# Altium schematic sheet Ampifiler.SchDoc: Sound Card Amplifiers
size Tabloid; Date: 05/10/2023; Engineer: Terry D. Scchevker; Revision: 1.0; SheetNumber: 2; SheetTotal: 4
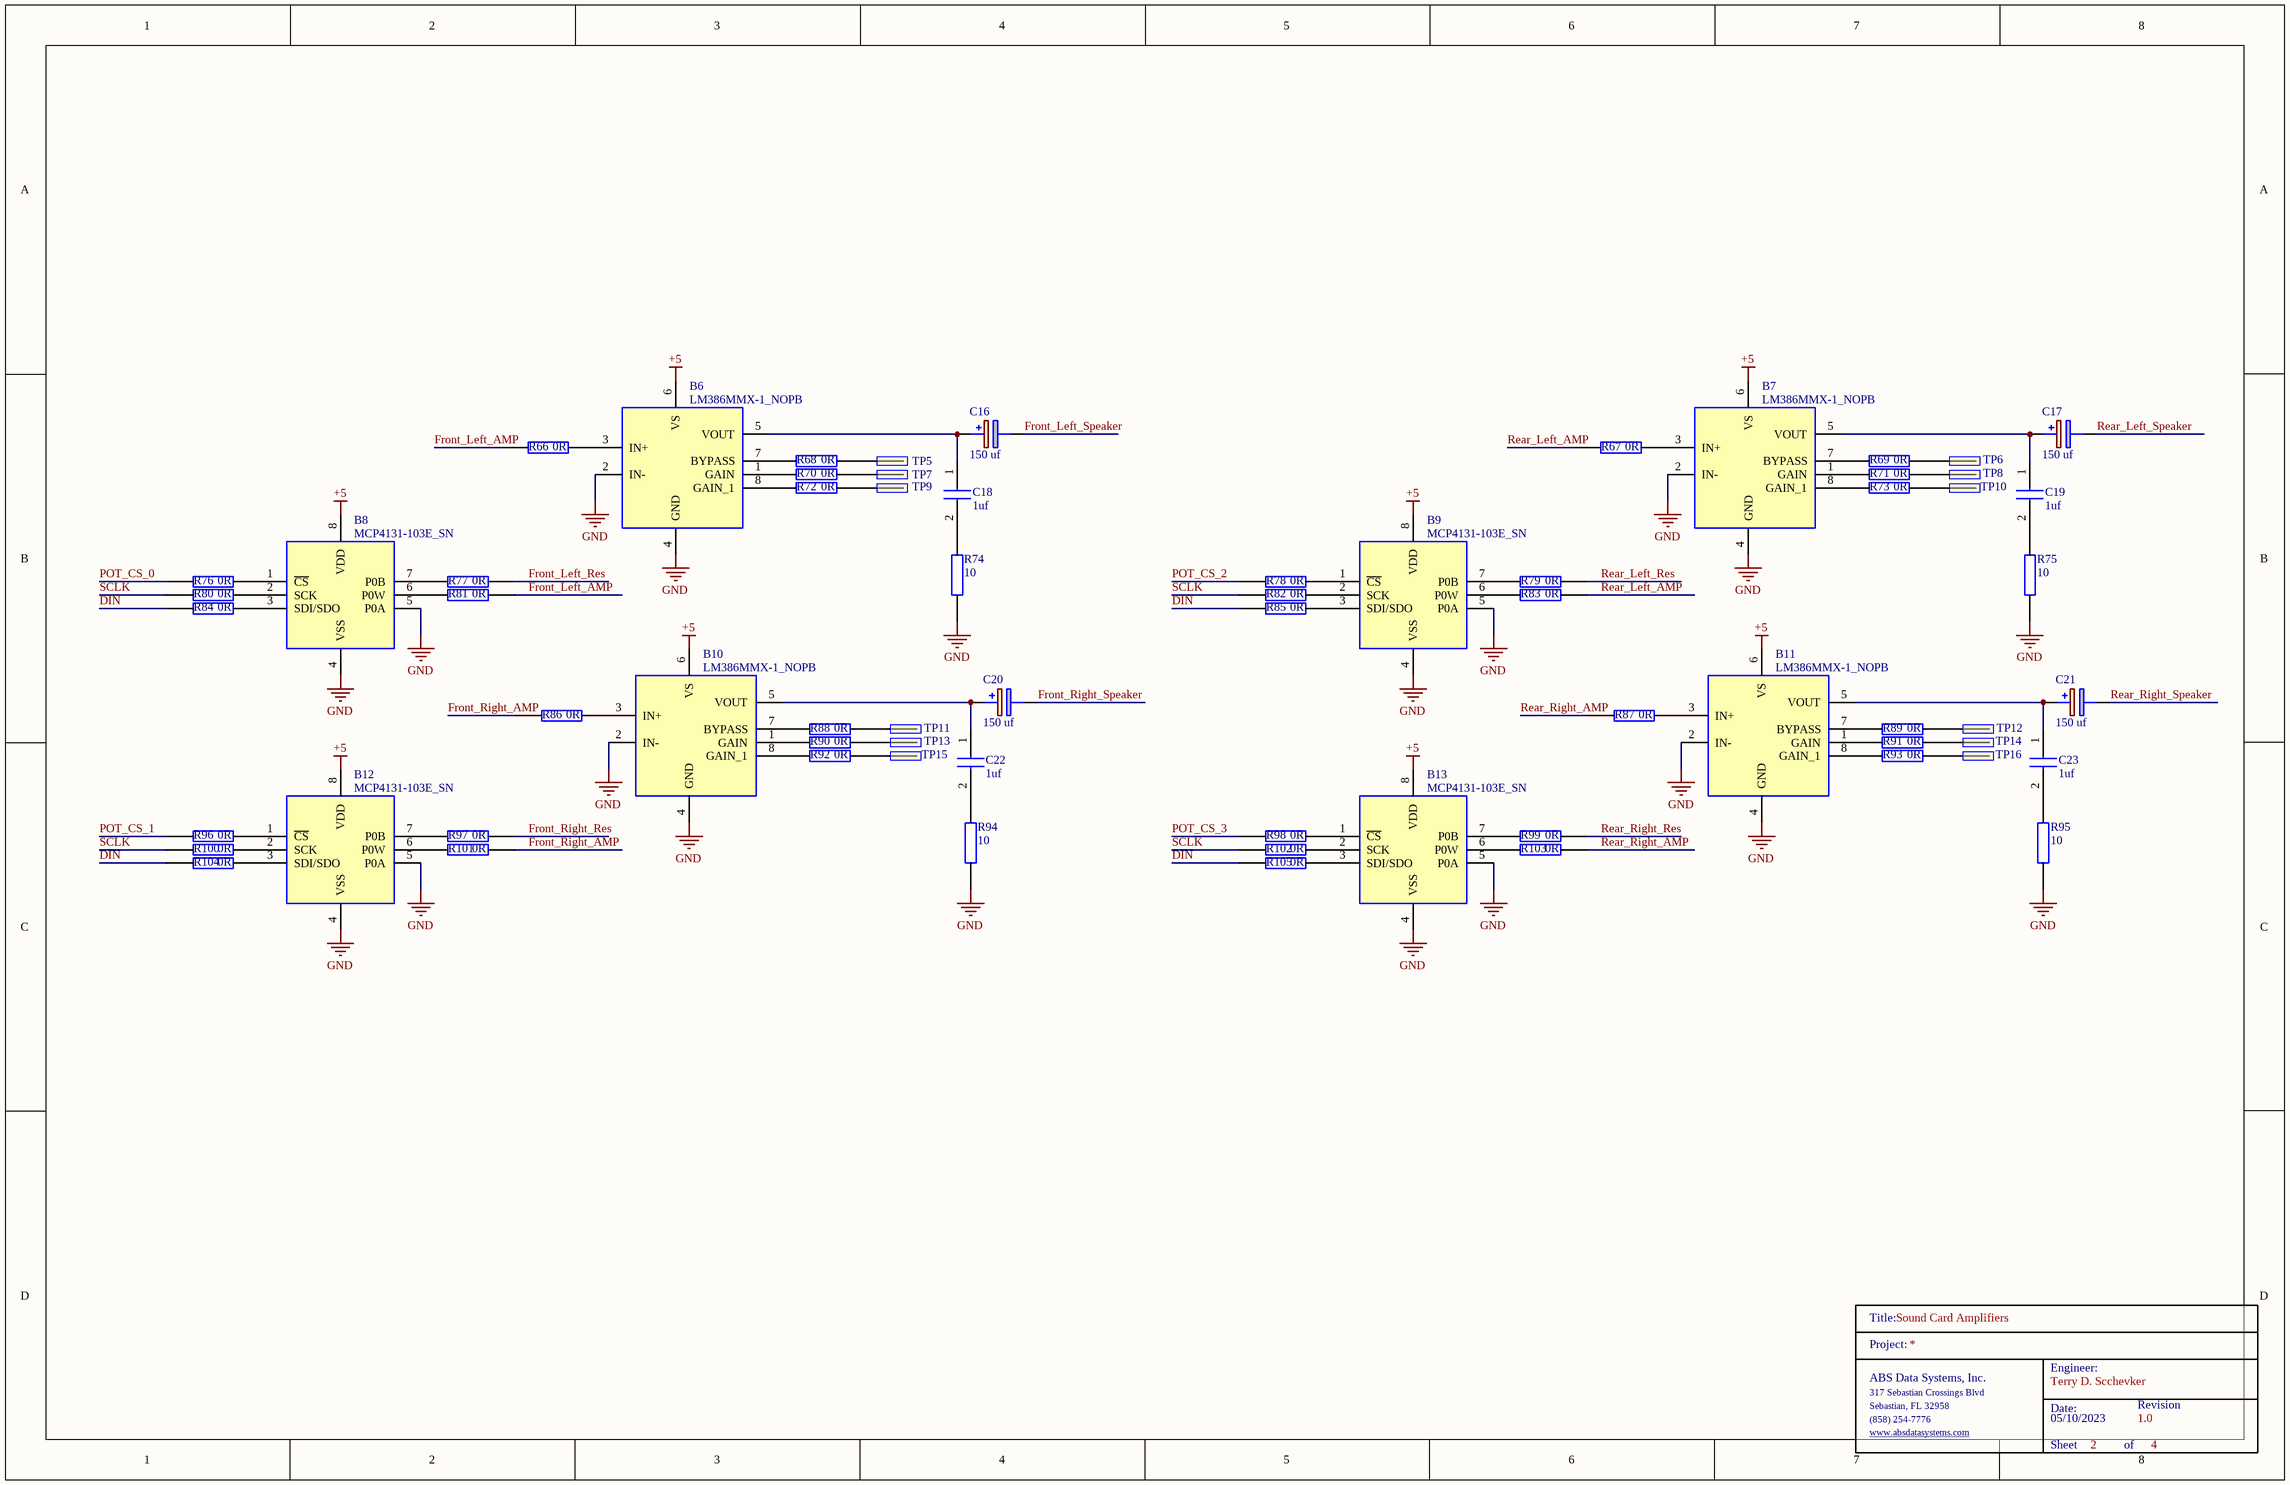
[diagram p0: Ampifiler.SchDoc]

## Parts
B6  LM386MMX-1_NOPB  [SOP65P490X110-8N]
B7  LM386MMX-1_NOPB  [SOP65P490X110-8N]
B8  MCP4131-103E_SN  [SOIC127P600X175-8N]
B9  MCP4131-103E_SN  [SOIC127P600X175-8N]
B10  LM386MMX-1_NOPB  [SOP65P490X110-8N]
B11  LM386MMX-1_NOPB  [SOP65P490X110-8N]
B12  MCP4131-103E_SN  [SOIC127P600X175-8N]
B13  MCP4131-103E_SN  [SOIC127P600X175-8N]
C16  150 uf  [CAPAE830X1050N]
C17  150 uf  [CAPAE830X1050N]
C18  1uf  [0603]
C19  1uf  [0603]
C20  150 uf  [CAPAE830X1050N]
C21  150 uf  [CAPAE830X1050N]
C22  1uf  [0603]
C23  1uf  [0603]
R66  0R  [0603]
R67  0R  [0603]
R68  0R  [0603]
R69  0R  [0603]
R70  0R  [0603]
R71  0R  [0603]
R72  0R  [0603]
R73  0R  [0603]
R74  10  [0603]
R75  10  [0603]
R76  0R  [0603]
R77  0R  [0603]
R78  0R  [0603]
R79  0R  [0603]
R80  0R  [0603]
R81  0R  [0603]
R82  0R  [0603]
R83  0R  [0603]
R84  0R  [0603]
R85  0R  [0603]
R86  0R  [0603]
R87  0R  [0603]
R88  0R  [0603]
R89  0R  [0603]
R90  0R  [0603]
R91  0R  [0603]
R92  0R  [0603]
R93  0R  [0603]
R94  10  [0603]
R95  10  [0603]
R96  0R  [0603]
R97  0R  [0603]
R98  0R  [0603]
R99  0R  [0603]
R100  0R  [0603]
R101  0R  [0603]
R102  0R  [0603]
R103  0R  [0603]
R104  0R  [0603]
R105  0R  [0603]
TitleBlock_?  TitleBlock  (value not drawn)  (graphical)
TP5  TP  [TP]  (value not drawn)
TP6  TP  [TP]  (value not drawn)
TP7  TP  [TP]  (value not drawn)
TP8  TP  [TP]  (value not drawn)
TP9  TP  [TP]  (value not drawn)
TP10  TP  [TP]  (value not drawn)
TP11  TP  [TP]  (value not drawn)
TP12  TP  [TP]  (value not drawn)
TP13  TP  [TP]  (value not drawn)
TP14  TP  [TP]  (value not drawn)
TP15  TP  [TP]  (value not drawn)
TP16  TP  [TP]  (value not drawn)

## Nets
+5: B6.6(VS) B7.6(VS) B8.8(VDD) B9.8(VDD) B10.6(VS) B11.6(VS) B12.8(VDD) B13.8(VDD)
GND: B6.2(IN-) B6.4(GND) B7.2(IN-) B7.4(GND) B8.4(VSS) B8.5(P0A) B9.4(VSS) B9.5(P0A) B10.2(IN-) B10.4(GND) B11.2(IN-) B11.4(GND) B12.4(VSS) B12.5(P0A) B13.4(VSS) B13.5(P0A) R74.1 R75.1 R94.1 R95.1
DIN: R84.1 R85.1 R104.1 R105.1
Front_Left_AMP: R66.1 R81.2
Front_Left_Res: R77.2
Front_Left_Speaker: C16.2(-)
Front_Right_AMP: R86.1 R101.2
Front_Right_Res: R97.2
Front_Right_Speaker: C20.2(-)
POT_CS_0: R76.1
POT_CS_1: R96.1
POT_CS_2: R78.1
POT_CS_3: R98.1
Rear_Left_AMP: R67.1 R83.2
Rear_Left_Res: R79.2
Rear_Left_Speaker: C17.2(-)
Rear_Right_AMP: R87.1 R103.2
Rear_Right_Res: R99.2
Rear_Right_Speaker: C21.2(-)
SCLK: R80.1 R82.1 R100.1 R102.1
NetB6_1: B6.1(GAIN) R70.1
NetB6_3: B6.3(IN+) R66.2
NetB6_5: B6.5(VOUT) C16.1(+) C18.1
NetB6_7: B6.7(BYPASS) R68.1
NetB6_8: B6.8(GAIN_1) R72.1
NetB7_1: B7.1(GAIN) R71.1
NetB7_3: B7.3(IN+) R67.2
NetB7_5: B7.5(VOUT) C17.1(+) C19.1
NetB7_7: B7.7(BYPASS) R69.1
NetB7_8: B7.8(GAIN_1) R73.1
NetB8_1: B8.1(~{CS}) R76.2
NetB8_2: B8.2(SCK) R80.2
NetB8_3: B8.3(SDI/SDO) R84.2
NetB8_6: B8.6(P0W) R81.1
NetB8_7: B8.7(P0B) R77.1
NetB9_1: B9.1(~{CS}) R78.2
NetB9_2: B9.2(SCK) R82.2
NetB9_3: B9.3(SDI/SDO) R85.2
NetB9_6: B9.6(P0W) R83.1
NetB9_7: B9.7(P0B) R79.1
NetB10_1: B10.1(GAIN) R90.1
NetB10_3: B10.3(IN+) R86.2
NetB10_5: B10.5(VOUT) C20.1(+) C22.1
NetB10_7: B10.7(BYPASS) R88.1
NetB10_8: B10.8(GAIN_1) R92.1
NetB11_1: B11.1(GAIN) R91.1
NetB11_3: B11.3(IN+) R87.2
NetB11_5: B11.5(VOUT) C21.1(+) C23.1
NetB11_7: B11.7(BYPASS) R89.1
NetB11_8: B11.8(GAIN_1) R93.1
NetB12_1: B12.1(~{CS}) R96.2
NetB12_2: B12.2(SCK) R100.2
NetB12_3: B12.3(SDI/SDO) R104.2
NetB12_6: B12.6(P0W) R101.1
NetB12_7: B12.7(P0B) R97.1
NetB13_1: B13.1(~{CS}) R98.2
NetB13_2: B13.2(SCK) R102.2
NetB13_3: B13.3(SDI/SDO) R105.2
NetB13_6: B13.6(P0W) R103.1
NetB13_7: B13.7(P0B) R99.1
NetC18_2: C18.2 R74.2
NetC19_2: C19.2 R75.2
NetC22_2: C22.2 R94.2
NetC23_2: C23.2 R95.2
NetR68_2: R68.2 TP5.1
NetR69_2: R69.2 TP6.1
NetR70_2: R70.2 TP7.1
NetR71_2: R71.2 TP8.1
NetR72_2: R72.2 TP9.1
NetR73_2: R73.2 TP10.1
NetR88_2: R88.2 TP11.1
NetR89_2: R89.2 TP12.1
NetR90_2: R90.2 TP13.1
NetR91_2: R91.2 TP14.1
NetR92_2: R92.2 TP15.1
NetR93_2: R93.2 TP16.1

## Notes on the sheet
- (in symbol TitleBlock) Title:; Project:; Engineer:; ABS Data Systems, Inc.; 317 Sebastian Crossings Blvd; Sebastian, FL 32958; Date:; Revision; (858) 254-7776; www.absdatasystems.com; Sheet; of

## Library data of the parts
B6 B7 B10 B11 = LM386MMX-1_NOPB: Wide Input Voltage Low Power Audio Amplifier with Internal Gain; Manufacturer_Name: Texas Instruments; Manufacturer_Part_Number: LM386MMX-1/NOPB; Geometry.Height: 1.1mm; Mouser Part Number: 926-LM386MMX-1/NOPB; Mouser Price/Stock: https://www.mouser.co.uk/ProductDetail/Texas-Instruments/LM386MMX-1-NOPB?qs=QbsRYf82W3EjpN1OWIJmZA%3D%3D; Datasheet Link: http://www.ti.com/lit/gpn/lm386
B8 B9 B12 B13 = MCP4131-103E_SN: Digital Potentiometer 128 Step 10kOhm; Manufacturer_Name: Microchip; Manufacturer_Part_Number: MCP4132-103E/SN; Geometry.Height: 1.75mm; Mouser Part Number: 579-MCP4132-103E/SN; Mouser Price/Stock: https://www.mouser.co.uk/ProductDetail/Microchip-Technology/MCP4132-103E-SN?qs=hH%252BOa0VZEiDq5PW83qTf7Q%3D%3D; Datasheet Link: http://ww1.microchip.com/downloads/en/DeviceDoc/22060b.pdf
C16 C17 C20 C21 = 865080553013: Wurth Elektronik 150uF 35 V dc Aluminium Electrolytic Capacitor, WCAP-ASLI Series 2000h 8 (Dia.) x 10.35mm; Geometry.Height: 10.5mm; Mouser Part Number: 710-865080553013; Mouser Price/Stock: https://www.mouser.co.uk/ProductDetail/Wurth-Elektronik/865080553013?qs=0KOYDY2FL29Thrvp1T0nKg%3D%3D; Manufacturer_Name: Wurth Elektronik; Manufacturer_Part_Number: 865080553013; Datasheet Link: https://www.we-online.com/catalog/datasheet/865080553013.pdf
C18 C19 C22 C23 = CL10B105KA8NNNL: Samsung Electro-Mechanics 0603 1uf
R66-R73 R76-R93 R96-R105 = RC0603JR-070RL: YAGEO 0603 0 ohm; Manufacturer_Name: KEMET; Geometry.Height: 0.55mm; Mouser Part Number: 603-RC0603JR-070RL; Mouser Price/Stock: https://www.mouser.co.uk/ProductDetail/YAGEO/RC0603JR-070RL?qs=2cAdsCoAWRGWyPcuXgGiXQ%3D%3D; Manufacturer_Part_Number: RC0603JR-070RL; Datasheet Link: https://datasheet.datasheetarchive.com/originals/distributors/Datasheets_SAMA/902f9e387b938f871d31120f5fc1d65e.pdf
R74 R75 R94 R95 = RC0603JR-0710L: YAGEO 0603 10 ohm; Manufacturer_Name: KEMET; Manufacturer_Part_Number: RC0603JR-070RL; Geometry.Height: 0.55mm; Mouser Part Number: 603-RC0603JR-070RL; Mouser Price/Stock: https://www.mouser.co.uk/ProductDetail/YAGEO/RC0603JR-070RL?qs=2cAdsCoAWRGWyPcuXgGiXQ%3D%3D; Datasheet Link: https://datasheet.datasheetarchive.com/originals/distributors/Datasheets_SAMA/902f9e387b938f871d31120f5fc1d65e.pdf
TP5-TP16 = TP: Manufacturer: Samtec; Manufacturer Part Number: TST-105-01-G-D; Number of Contacts: 16; Gender: Male; Connector Type: Male Pin; Pitch: 2.54mm; Row Spacing: 0.1inch; Supplier 1: Digi-Key; RoHS: Yes; Category: Headers and Wire Housings; Stock 1: 227; Pricing 1: 1=2.85000, 10=2.73600, 100=2.28000, 500=1.93800, 1000=1.65300, 5000=1.48200 (USD); Mount: Through Hole; Contact Plating: Gold; Contact Material: Bronze; Housing Material: Polyester; Housing Color: Black; Color: Black; Min Operating Temperature: -55°C; Max Operating Temperature: 125°C; Number of Rows: 2; Termination: Solder; Packaging: Rail/Tube; Orientation: Straight; Number of Positions: 16; Length: 27.94mm; Depth: 9.27mm; Contact Mating Length: 0.25inch; REACH SVHC: No SVHC; ComponentLink1URL: https://datasheet.ciiva.com/739/tst-mkt-739845.pdf?src-supplier=Digi-Key; ComponentLink1Description: https://datasheet.ciiva.com/739/tst-mkt-739845.pdf?src-supplier=Digi-Key; ComponentLink2URL: https://datasheet.ciiva.com/10018/htst-10018510.pdf?src-supplier=Avnet; ComponentLink2Description: https://datasheet.ciiva.com/10018/htst-10018510.pdf?src-supplier=Avnet